# Altium schematic sheet DDRMemory.SchDoc
size A4; SheetNumber: 8; SheetTotal: 9
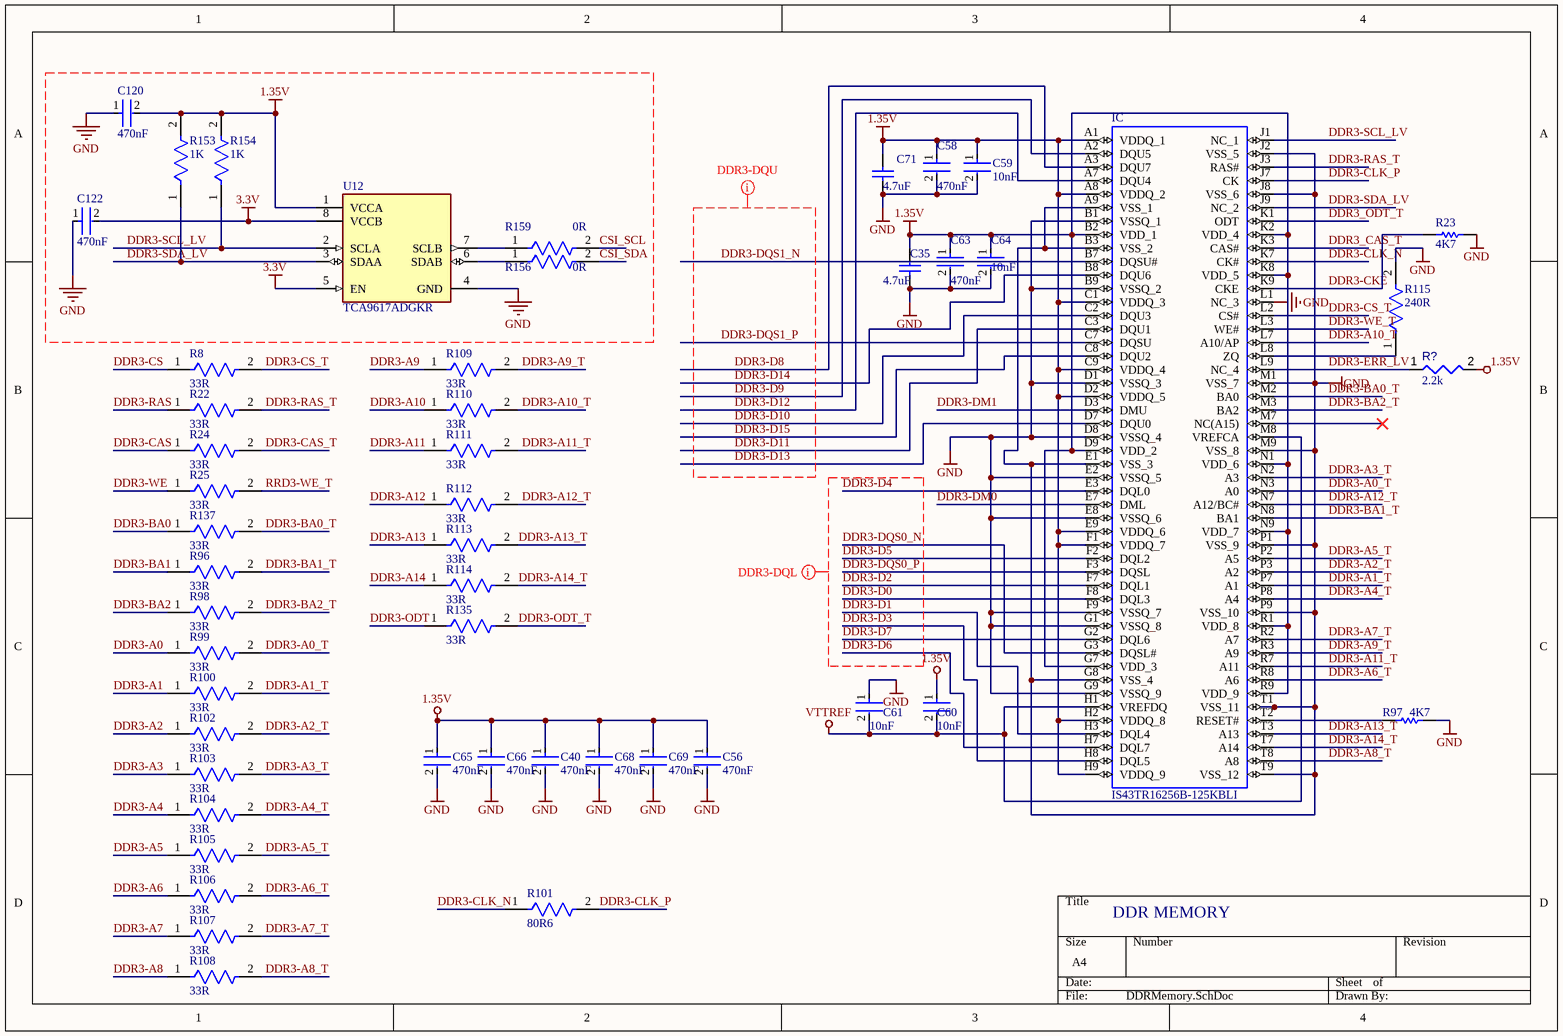
[diagram p0: DDRMemory.SchDoc]

## Parts
C35  4.7uF  [CAPC1005X71X25NL10T15]
C40  470nF  [FP-0603-L_1_6_0_1-W_0_8_0-IPC_C]
C56  470nF  [FP-0603-L_1_6_0_1-W_0_8_0-IPC_C]
C58  470nF  [FP-0402-L_1_0_1-W_0_5_0_1-IPC_C]
C59  10nF  [FP-CC0402-MFG]
C60  10nF  [FP-CC0402-MFG]
C61  10nF  [FP-CC0402-MFG]
C63  470nF  [FP-0402-L_1_0_1-W_0_5_0_1-IPC_C]
C64  10nF  [FP-CC0402-MFG]
C65  470nF  [FP-0603-L_1_6_0_1-W_0_8_0-IPC_C]
C66  470nF  [FP-0603-L_1_6_0_1-W_0_8_0-IPC_C]
C68  470nF  [FP-0603-L_1_6_0_1-W_0_8_0-IPC_C]
C69  470nF  [FP-0603-L_1_6_0_1-W_0_8_0-IPC_C]
C71  4.7uF  [CAPC1005X71X25NL10T15]
C120  470nF  [FP-CC0603-DA-MFG]
C122  470nF  [FP-CC0603-DA-MFG]
IC  IS43TR16256B-125KBLI  [BGA96C80P9X16_900X1300X120]
R8  33R  [FP-AF0201-IPC_A]
R22  33R  [FP-AF0201-IPC_A]
R23  4K7  [RESC1812(4532)_N]
R24  33R  [FP-AF0201-IPC_A]
R25  33R  [FP-AF0201-IPC_A]
R96  33R  [FP-AF0201-IPC_A]
R97  4K7  [RESC1812(4532)_N]
R98  33R  [FP-AF0201-IPC_A]
R99  33R  [FP-AF0201-IPC_A]
R100  33R  [FP-AF0201-IPC_A]
R101  80R6  [FP-RQ732B-IPC_C]
R102  33R  [FP-AF0201-IPC_A]
R103  33R  [FP-AF0201-IPC_A]
R104  33R  [FP-AF0201-IPC_A]
R105  33R  [FP-AF0201-IPC_A]
R106  33R  [FP-AF0201-IPC_A]
R107  33R  [FP-AF0201-IPC_A]
R108  33R  [FP-AF0201-IPC_A]
R109  33R  [FP-AF0201-IPC_A]
R110  33R  [FP-AF0201-IPC_A]
R111  33R  [FP-AF0201-IPC_A]
R112  33R  [FP-AF0201-IPC_A]
R113  33R  [FP-AF0201-IPC_A]
R114  33R  [FP-AF0201-IPC_A]
R115  240R  [FP-RNCP0402-IPC_C]
R135  33R  [FP-AF0201-IPC_A]
R137  33R  [FP-AF0201-IPC_A]
R153  1K  [FP-AC0603-IPC_B]
R154  1K  [FP-AC0603-IPC_B]
R156  0R  [FP-AC0603-IPC_A]
R159  0R  [FP-AC0603-IPC_A]
R?  value 2.2k  [RESC0402(1005)_L]  (hidden comment: 2D2KR2J)
U12  TCA9617ADGKR  [FP-DGK0008A-MFG]

## Nets
1.35V: C35.2 C40.1 C56.1 C58.1 C59.1 C60.1 C63.1 C64.1 C65.1 C66.1 C68.1 C69.1 C71.2 C120.2 IC.A1(VDDQ_1) IC.A8(VDDQ_2) IC.B2(VDD_1) IC.C1(VDDQ_3) IC.C9(VDDQ_4) IC.D2(VDDQ_5) IC.D9(VDD_2) IC.E9(VDDQ_6) IC.F1(VDDQ_7) IC.G7(VDD_3) IC.H2(VDDQ_8) IC.H9(VDDQ_9) IC.K2(VDD_4) IC.K8(VDD_5) IC.N1(VDD_6) IC.N9(VDD_7) IC.R1(VDD_8) IC.R9(VDD_9) R153.2 R154.2 U12.1(VCCA)
3.3V: C122.2 U12.5(EN) U12.8(VCCB)
GND: C35.1 C40.2 C56.2 C58.2 C59.2 C61.1 C63.2 C64.2 C65.2 C66.2 C68.2 C69.2 C71.1 C120.1 C122.1 IC.A9(VSS_1) IC.B1(VSSQ_1) IC.B3(VSS_2) IC.B9(VSSQ_2) IC.D1(VSSQ_3) IC.D8(VSSQ_4) IC.E1(VSS_3) IC.E2(VSSQ_5) IC.E8(VSSQ_6) IC.F9(VSSQ_7) IC.G1(VSSQ_8) IC.G8(VSS_4) IC.G9(VSSQ_9) IC.J2(VSS_5) IC.J8(VSS_6) IC.L1(NC_3) IC.M1(VSS_7) IC.M9(VSS_8) IC.P1(VSS_9) IC.P9(VSS_10) IC.T1(VSS_11) IC.T9(VSS_12) R23.2 R97.2 R115.2 R?.2 U12.4(GND)
VTTREF: C60.2 C61.2 IC.H1(VREFDQ) IC.M8(VREFCA)
CSI_SCL: R159.2
CSI_SDA: R156.2
DDR3-A0: R99.1
DDR3-A0_T: IC.N3(A0) R99.2
DDR3-A1: R100.1
DDR3-A1_T: IC.P7(A1) R100.2
DDR3-A2: R102.1
DDR3-A2_T: IC.P3(A2) R102.2
DDR3-A3: R103.1
DDR3-A3_T: IC.N2(A3) R103.2
DDR3-A4: R104.1
DDR3-A4_T: IC.P8(A4) R104.2
DDR3-A5: R105.1
DDR3-A5_T: IC.P2(A5) R105.2
DDR3-A6: R106.1
DDR3-A6_T: IC.R8(A6) R106.2
DDR3-A7: R107.1
DDR3-A7_T: IC.R2(A7) R107.2
DDR3-A8: R108.1
DDR3-A8_T: IC.T8(A8) R108.2
DDR3-A9: R109.1
DDR3-A9_T: IC.R3(A9) R109.2
DDR3-A10: R110.1
DDR3-A10_T: IC.L7(A10/AP) R110.2
DDR3-A11: R111.1
DDR3-A11_T: IC.R7(A11) R111.2
DDR3-A12: R112.1
DDR3-A12_T: IC.N7(A12/BC#) R112.2
DDR3-A13: R113.1
DDR3-A13_T: IC.T3(A13) R113.2
DDR3-A14: R114.1
DDR3-A14_T: IC.T7(A14) R114.2
DDR3-BA0: R137.1
DDR3-BA0_T: IC.M2(BA0) R137.2
DDR3-BA1: R96.1
DDR3-BA1_T: IC.N8(BA1) R96.2
DDR3-BA2: R98.1
DDR3-BA2_T: IC.M3(BA2) R98.2
DDR3-CAS: R24.1
DDR3-CAS_T: R24.2
DDR3-CKE: IC.K9(CKE) R23.1
DDR3-CLK_N: IC.K7(CK#) R101.1
DDR3-CLK_P: IC.J7(CK) R101.2
DDR3-CS: R8.1
DDR3-CS_T: IC.L2(CS#) R8.2
DDR3-D0: IC.F8(DQL3)
DDR3-D1: IC.H3(DQL4)
DDR3-D2: IC.F7(DQL1)
DDR3-D3: IC.H8(DQL5)
DDR3-D4: IC.E3(DQL0)
DDR3-D5: IC.F2(DQL2)
DDR3-D6: IC.H7(DQL7)
DDR3-D7: IC.G2(DQL6)
DDR3-D8: IC.A3(DQU7)
DDR3-D9: IC.A2(DQU5)
DDR3-D10: IC.C2(DQU3)
DDR3-D11: IC.C3(DQU1)
DDR3-D12: IC.A7(DQU4)
DDR3-D13: IC.D7(DQU0)
DDR3-D14: IC.B8(DQU6)
DDR3-D15: IC.C8(DQU2)
DDR3-DM0: IC.E7(DML)
DDR3-DM1: IC.D3(DMU)
DDR3-DQS0_N: IC.G3(DQSL#)
DDR3-DQS0_P: IC.F3(DQSL)
DDR3-DQS1_N: IC.B7(DQSU#)
DDR3-DQS1_P: IC.C7(DQSU)
DDR3-ERR_LV: IC.L9(NC_4) R?.1
DDR3-ODT: R135.1
DDR3-ODT_T: R135.2
DDR3-RAS: R22.1
DDR3-RAS_T: IC.J3(RAS#) R22.2
DDR3-SCL_LV: IC.J1(NC_1) R154.1 U12.2(SCLA)
DDR3-SDA_LV: IC.J9(NC_2) R153.1 U12.3(SDAA)
DDR3-WE: R25.1
DDR3-WE_T: IC.L3(WE#)
DDR3_CAS_T: IC.K3(CAS#)
DDR3_ODT_T: IC.K1(ODT)
RRD3-WE_T: R25.2
NetIC_L8: IC.L8(ZQ) R115.1
NetIC_T2: IC.T2(RESET#) R97.1
NetR156_1: R156.1 U12.6(SDAB)
NetR159_1: R159.1 U12.7(SCLB)

Not connected (* = marked no-connect by the designer): IC M7(NC(A15))*

## Layout directives
mark named DDR3-DQU: DDR3-D8, DDR3-D9, DDR3-D10, DDR3-D11, DDR3-D12, DDR3-D13, DDR3-D14, DDR3-D15, DDR3-DQS1_N, DDR3-DQS1_P
mark named DDR3-DQL: DDR3-D0, DDR3-D1, DDR3-D2, DDR3-D3, DDR3-D4, DDR3-D5, DDR3-D6, DDR3-D7, DDR3-DQS0_N, DDR3-DQS0_P

## Notes on the sheet
- DDR MEMORY
- Labels drawn without touching a wire or pin: 1.35V

## Library data of the parts
C35 C71 = CMP-2008-02043-1: Part Number: 0402ZD475MAT2A; Manufacturer: AVX Interconnect / Elco
C40 C56 C65 C66 C68 C69 = CMP-14477-002910-2: None; Voltage Rating (DC): 16V; Tolerance: 20%; Dielectric: X7R; Dielectric Material: Ceramic; Length: 1.6mm; Series: M; Package Quantity: 4000; Case/Package: 0603; Thickness: 0.035inch; Depth: 0.8mm; Halogen Free: Halogen Free; Voltage Rating: 16V; Termination: SMD/SMT; Number of Pins: 2; Construction: Flat; RoHS Compliant: Yes; Weight: 7.1E-05oz; Height: 0.8mm; Capacitance: 470nF; Packaging: Tape and Reel; Max Operating Temperature: 125°C; Mount: Surface Mount; Radiation Hardening: No; Width: 0.031inch; Min Operating Temperature: -55°C; Case Code (Imperial): 0603; Case Code (Metric): 1608; Resistor Type: Ceramic
C58 C63 = CMP-04427-019216-1: General Purpose Ceramic Capacitor, 0402, 470nF, 10%, X7R, 15%, 10V; RoHS Compliant: Yes
C59-C61 C64 = CMP-03422-000189-1: CAP CER 10000PF 10V X7R 0402; Manufacturer Part Number: CC0402MRX7R6BB103; Manufacturer: YAGEO; Material: Ceramic; Automotive Grade: NA; Temperature Coefficient: 30ppm/°C; Tolerance: 0.2; Digikey Description: CAP CER 10000PF 10V X7R 0402; Package: CC0402; Height: 0.55mm; RoHS: TRUE; Temperature Characteristic: X7R; Ipc Land Pattern Name: CAPC10050X50; Device Class L3: Ceramic Capacitors; Value: 10 nF; Lead Free: Yes; ComponentLink2URL: http://www.yageo.com/documents/recent/UPY-GP_NP0_16V-to-50V_16.pdf; Device Class L2: Capacitors; Voltage Rating: 10 V; ComponentLink2Description: Datasheet; Mouser Description: Multilayer Ceramic Capacitors MLCC - SMD/SMT 10nF 10V X7R 20%; Automotive: No; Temperature Range Low: -55°C; Device Class L1: Passive Components; Category: Cap; Capacitance: 10 nF; Octopart: https://octopart.com/cc0402mrx7r6bb103-yageo-71334382; Temperature: -55°C to +125°C; Temperature Range High: +125°C; Footprint Url: http://www.yageo.com/exep/pages/download/literatures/UPY-C_GEN_24.pdf
C120 C122 = CMP-03422-000186-1: CAP CER 0.47UF 6.3V X5R 0603; Manufacturer Part Number: CC0603KRX5R5BB474; Manufacturer: YAGEO; Temperature Coefficient: 15%; Tolerance: 0.1; Material: Ceramic; Device Class L3: Ceramic Capacitors; Temperature Range Low: -55°C; ComponentLink2Description: Datasheet; Lead Free: Yes; Height: 0.9mm; Category: Cap; Value: 470 nF; Voltage: 6.3 V; Mouser Description: Multilayer Ceramic Capacitors MLCC - SMD/SMT 470nF 6.3V X5R 10%; Capacitance: 470 nF; Octopart: https://octopart.com/cc0603krx5r5bb474-yageo-9288194; Temperature Characteristic: X5R; Digikey Description: CAP CER 0.47UF 6.3V X5R 0603; Automotive: No; Voltage Rating: 6.3 V; RoHS: TRUE; Device Class L1: Passive Components; Footprint Url: http://www.yageo.com/exep/pages/download/literatures/UPY-C_GEN_24.pdf; Temperature Range High: +125°C; Temperature: -55°C to +125°C; Device Class L2: Capacitors; Package: CC0603-DA; ComponentLink2URL: http://www.yageo.com/documents/recent/UPY-GPHC_X7R_6.3V-to-50V_18.pdf
IC = IS43TR16256B-125KBLI: SDRAM - DDR3 Memory IC 4Gb (256M x 16) Parallel 800MHz 20ns 96-TWBGA (9x13); MF: ISSI, Integrated Silicon Solution Inc; Availability: Unavailable; Mouser-Purchase-URL: https://snapeda.com/shop?store=Mouser&id=3661934; Price: None; DigiKey-Purchase-URL: https://snapeda.com/shop?store=DigiKey&id=3661934; Package: TFBGA-96 ISSI, Integrated Silicon Solution Inc; Value: *; SnapEDA_Link: https://www.snapeda.com/parts/IS43TR16256B-125KBLI/ISSI,%20Integrated%20Silicon%20Solution%20Inc/view-part/3661934/?ref=snap; MP: IS43TR16256B-125KBLI
R8 R22 R24 R25 R96 R98-R100 R102-R114 R135 R137 = CMP-03412-042108-1: Anti-Sulfurated Chip Resistors Automotive Grade 33Ω 5% 200ppm/°C 0201; Max Power Dissipation: 50mW; Number of Terminations: 2; Resistance: 33R; Series: AF; RoHS Compliant: Yes; Temperature Coefficient: 200ppm/°C; Length: 0.024inch; Max Operating Temperature: 125°C; Tolerance: 5%; Height: 0.01inch; Case/Package: 0201; Packaging: Tape and Reel; Min Operating Temperature: -55°C; Features: Moisture Resistant; Width: 0.012inch; Resistor Type: Thick Film
R23 R97 = CMP-1016-00090-1: 4K7 0.75W 5% 1812 (4532 Metric)  SMD; Case-Metric: 4532; Case-EIA: 1812; Value: 4700.00 Ohm; Tolerance: 5 %; Power: 0.75 W; Technology: SMT
R101 = CMP-03211-009713-1: RQ732B 1206 80.6Ω 0.4W 10ppm/°C 0.1% 200V; Manufacturer Part Number: RQ73C2B80R6BTDF; Manufacturer: TE; Automotive Grade: Grade 0; Temperature: -55°C to +155°C; Device Class L1: Passive Components; Temperature Coefficient: 10ppm/°C; Temperature Range High: +155°C; ComponentLink2URL: https://www.te.com/commerce/DocumentDelivery/DDEController?Action=showdoc&DocId=Data+Sheet%7F1773270-2%7FA%7Fpdf%7FEnglish%7FENG_DS_1773270-2_A.pdf%7F9-2176388-1024; Resistance: 80.6Ω; Height: 0.75mm; Device Class L2: Resistors; RoHS: TRUE; Automotive: Yes; ComponentLink2Description: Datasheet; Voltage Rating: 200V; Composition: Thin Film; Lead Free: Yes; Tolerance: 0.1%; Value: 80.6Ω; Ipc Land Pattern Name: RESC310160X60; Device Class L3: Chip SMD Resistors; Power Rating: 0.4W; Octopart: https://octopart.com/rq73c2b80r6btdf-te+connectivity-99292777; Package: RQ732B; Temperature Range Low: -55°C; Category: Res; Series: RQ73
R115 = CMP-26527-003352-1: 240Ω ±1% 0.1W 0402 High Power Anti-Sulfur Thin Film Chip Resistor; Temperature Coefficient: 100ppm/°C; Mount: Surface Mount; Contact Plating: Tin; Tolerance: 1%; Max Operating Temperature: 155°C; Resistance: 240R; RoHS Compliant: Yes; Packaging: Tape and Reel; Min Operating Temperature: -55°C; Resistor Type: Thin Film; Radiation Hardening: No; Case/Package: 0402
R153 R154 = CMP-03412-047577-1: RES 1kΩ 1.00% 0.2W 0603
R156 R159 = CMP-03412-047235-1: RES 0Ω 0.00% 0.1W 0603; Tolerance: 5%; Resistance: 0mR; Case/Package: 0603; RoHS Compliant: Yes; Lead Free: Lead Free
R? = CMP-009-00087-2: 2K2 0.063W 5% 0402 (1005 Metric)  SMD; Power: 63mW; Mounting Technology: SMT; Tolerance: 5%; Case/Package: 0402; Pins: 2
U12 = CMP-04881-000003-1: IC TRNSLTR BIDIRECTIONAL 8VSSOP; Manufacturer: Texas Instruments; Standoff Height: 0.05mm; Sigbufrep Type: Buffer; Interface: I2C; Delay Time: 94ns; Data Rate: 1Mbits/s; Max Supply Voltage: 5.5V; Min Supply Voltage: 0.8V; Input Capacitance: 9-14pF; Signal Conditioning: NA; Automotive: No; Ipc Land Pattern Name: SOP65P300X110-8; Temperature: -40°C to +85°C; ComponentLink2URL: http://www.ti.com/lit/ds/symlink/tca9617a.pdf; Temperature Range High: +85°C; Digikey Description: IC TRNSLTR BIDIRECTIONAL 8VSSOP; RoHS: TRUE; Height: 1.1mm; Device Class L2: Interface ICs; Lead Free: Yes; Ambient Temperature Range High: +85°C; Ambient Temperature Range Low: -40°C; Manufacturer Part Number: TCA9617ADGKR; Category: IC; Device Class L3: Repeaters; Mouser Description: IC V-LEVEL XLATR FM+ I2C 8VSSOP; Package: DGK0008A; ComponentLink2Description: Datasheet; Device Class L1: Integrated Circuits (ICs); Temperature Range Low: -40°C; Octopart: https://octopart.com/tca9617adgkr-texas+instruments-29775809